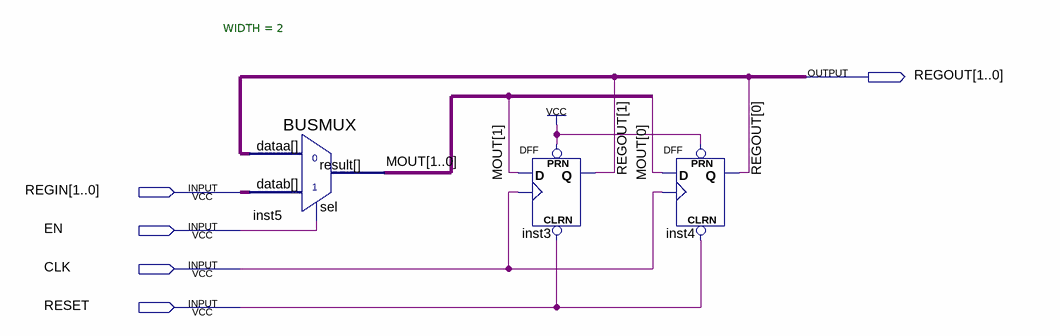
[diagram p0: schematic sheet]
// Quartus schematic Register2Bits.bdf as structural Verilog: 3 symbols, 5 pins
module Register2Bits (
  input  [1:0] REGIN,
  input  EN,
  input  CLK,
  input  RESET,
  output [1:0] REGOUT
);

  wire [1:0] MOUT;

  BUSMUX #(.WIDTH(2)) inst5 (.datab(REGIN), .sel(EN), .dataa(REGOUT), .result(MOUT));
  DFF inst3 (.CLRN(RESET), .CLK(CLK), .D(MOUT[1]), .PRN(1'b1), .Q(REGOUT[1]));
  DFF inst4 (.CLRN(RESET), .CLK(CLK), .D(MOUT[0]), .PRN(1'b1), .Q(REGOUT[0]));
endmodule
